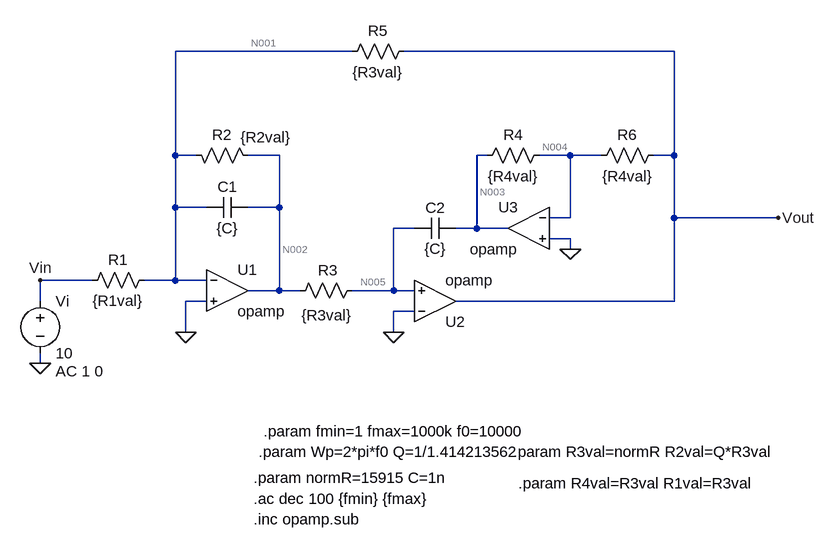
[diagram p0: schematic TS3_simulacion.asc]
TS3_simulacion.asc, the LTspice schematic file:
Version 4
SHEET 1 1152 1072
WIRE -64 304 -336 304
WIRE 432 304 16 304
WIRE -336 464 -336 304
WIRE -304 464 -336 464
WIRE -176 464 -224 464
WIRE 144 464 128 464
WIRE 272 464 224 464
WIRE 320 464 272 464
WIRE 432 464 432 304
WIRE 432 464 400 464
WIRE -336 544 -336 464
WIRE -288 544 -336 544
WIRE -176 544 -176 464
WIRE -176 544 -224 544
WIRE 272 560 272 464
WIRE 272 560 240 560
WIRE 432 560 432 464
WIRE 592 560 432 560
WIRE 32 576 0 576
WIRE 128 576 128 464
WIRE 128 576 96 576
WIRE 176 576 128 576
WIRE 272 592 240 592
WIRE 272 608 272 592
WIRE -464 656 -544 656
WIRE -336 656 -336 544
WIRE -336 656 -384 656
WIRE -288 656 -336 656
WIRE -176 672 -176 544
WIRE -176 672 -224 672
WIRE -144 672 -176 672
WIRE 0 672 0 576
WIRE 0 672 -64 672
WIRE 32 672 0 672
WIRE -544 688 -544 656
WIRE -288 688 -320 688
WIRE 432 688 432 560
WIRE 432 688 96 688
WIRE 32 704 0 704
WIRE -320 736 -320 688
WIRE 0 736 0 704
WIRE -544 784 -544 768
FLAG -544 656 Vin
FLAG 592 560 Vout
FLAG -544 784 0
FLAG -320 736 0
FLAG 0 736 0
FLAG 272 608 0
SYMBOL OpAmps\\opamp -256 608 R0
SYMATTR InstName U1
SYMBOL res -48 656 R90
WINDOW 0 0 53 VBottom 2
WINDOW 3 38 55 VTop 2
SYMATTR InstName R3
SYMATTR Value {R3val}
SYMBOL res -208 480 M270
WINDOW 0 32 56 VTop 2
WINDOW 3 60 -11 VBottom 2
SYMATTR InstName R2
SYMATTR Value {R2val}
SYMBOL cap -288 560 R270
WINDOW 0 32 32 VTop 2
WINDOW 3 0 32 VBottom 2
SYMATTR InstName C1
SYMATTR Value {C}
SYMBOL voltage -544 672 R0
WINDOW 123 24 124 Left 2
WINDOW 39 0 0 Left 0
SYMATTR Value2 AC 1 0
SYMATTR InstName Vi
SYMATTR Value 10
SYMBOL OpAmps\\opamp 64 752 M180
SYMATTR InstName U2
SYMBOL res 240 448 R90
WINDOW 0 0 56 VBottom 2
WINDOW 3 32 56 VTop 2
SYMATTR InstName R4
SYMATTR Value {R4val}
SYMBOL res -80 320 R270
WINDOW 0 32 56 VTop 2
WINDOW 3 0 56 VBottom 2
SYMATTR InstName R5
SYMATTR Value {R3val}
SYMBOL res -368 640 R90
WINDOW 0 0 56 VBottom 2
WINDOW 3 32 56 VTop 2
SYMATTR InstName R1
SYMATTR Value {R1val}
SYMBOL cap 96 560 R90
WINDOW 0 0 32 VBottom 2
WINDOW 3 32 32 VTop 2
SYMATTR InstName C2
SYMATTR Value {C}
SYMBOL OpAmps\\opamp 208 512 M0
SYMATTR InstName U3
SYMBOL res 416 448 R90
WINDOW 0 0 56 VBottom 2
WINDOW 3 32 56 VTop 2
SYMATTR InstName R6
SYMATTR Value {R4val}
TEXT -216 960 Left 2 !.param normR=15915 C=1n
TEXT -216 992 Left 2 !.ac dec 100 {fmin} {fmax}
TEXT -216 1024 Left 2 !.inc opamp.sub
TEXT -208 920 Left 2 !.param Wp=2*pi*f0 Q=1/1.414213562
TEXT -200 888 Left 2 !.param fmin=1 fmax=1000k f0=10000
TEXT 184 920 Left 2 !.param R3val=normR R2val=Q*R3val
TEXT 192 968 Left 2 !.param R4val=R3val R1val=R3val

The netlist it stands for:
* TS3_simulacion.asc
XU1 N001 0 N002 opamp Aol=100K GBW=10Meg  ; pins invin noninvin out
R3 N005 N002 {R3val}
R2 N002 N001 {R2val}
C1 N001 N002 {C}
Vi Vin 0 10 AC 1 0
XU2 0 N005 Vout opamp Aol=100K GBW=10Meg  ; pins invin noninvin out
R4 N004 N003 {R4val}
R5 N001 Vout {R3val}
R1 N001 Vin {R1val}
C2 N003 N005 {C}
XU3 N004 0 N003 opamp Aol=100K GBW=10Meg  ; pins invin noninvin out
R6 Vout N004 {R4val}
.param normR=15915 C=1n
.ac dec 100 {fmin} {fmax}
.inc opamp.sub
.param Wp=2*pi*f0 Q=1/1.414213562
.param fmin=1 fmax=1000k f0=10000
.param R3val=normR R2val=Q*R3val
.param R4val=R3val R1val=R3val
.backanno
.end

* Results of the author's LTspice run, read from the files saved beside the schematic
* Operating Point, zero values left out:
*   V(n002) = -100 µV
*   V(n005) = -100 µV
*   V(vin) = 10 V
*   V(vout) = -10 V
*   V(n004) = -100 µV
*   V(n003) = 10 V
*   I(R2) = -8.887 nA
*   I(R4) = -628.3 µA
*   I(R5) = 628.3 µA
*   I(R1) = -628.3 µA
*   I(R6) = -628.3 µA
*   I(Vi) = -628.3 µA
*   Ix(u1:3) = 8.887 nA
*   Ix(u2:3) = 1.257 mA
*   Ix(u3:3) = -628.3 µA
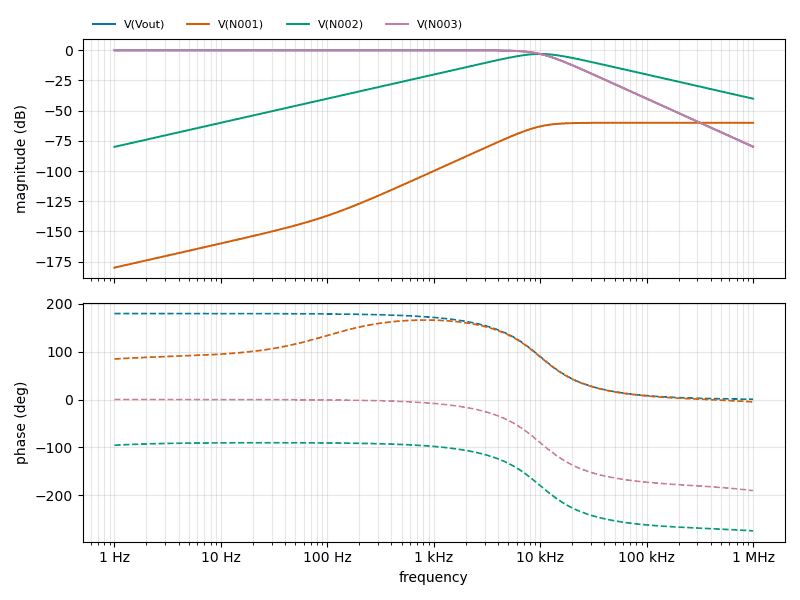
[diagram p1: AC Analysis of TS3_simulacion.asc, plotted from the saved traces]
* AC Analysis, 1 run:
*   V(Vout): -0.00 dB at 1 Hz, -79.77 dB at 1 MHz, peak -0.00 dB at 309 Hz, 3 dB below the peak at 9.99 kHz
*   V(N001): -179.95 dB at 1 Hz, -60.06 dB at 1 MHz, peak -60.02 dB at 109.6 kHz, 3 dB below the peak at 9.98 kHz
*   V(N002): -79.95 dB at 1 Hz, -40.06 dB at 1 MHz, peak -3.01 dB at 10 kHz, 3 dB below the peak at 5.17 kHz and 19.28 kHz
*   V(N003): -0.00 dB at 1 Hz, -79.94 dB at 1 MHz, peak -0.00 dB at 309 Hz, 3 dB below the peak at 9.99 kHz